# EasyEDA Pro project split-keyboard.epro, schematic Right top

## Sheets
1 P1: Board Name: Right top; Create Date: 2025-12-20; Page Name: P1; Project Name: split-keyboard-2025; Schematic Name: Right top; Update Date: 2025-12-20; Company: EasyEDA.com; Page Size: A4; Version: V1.0
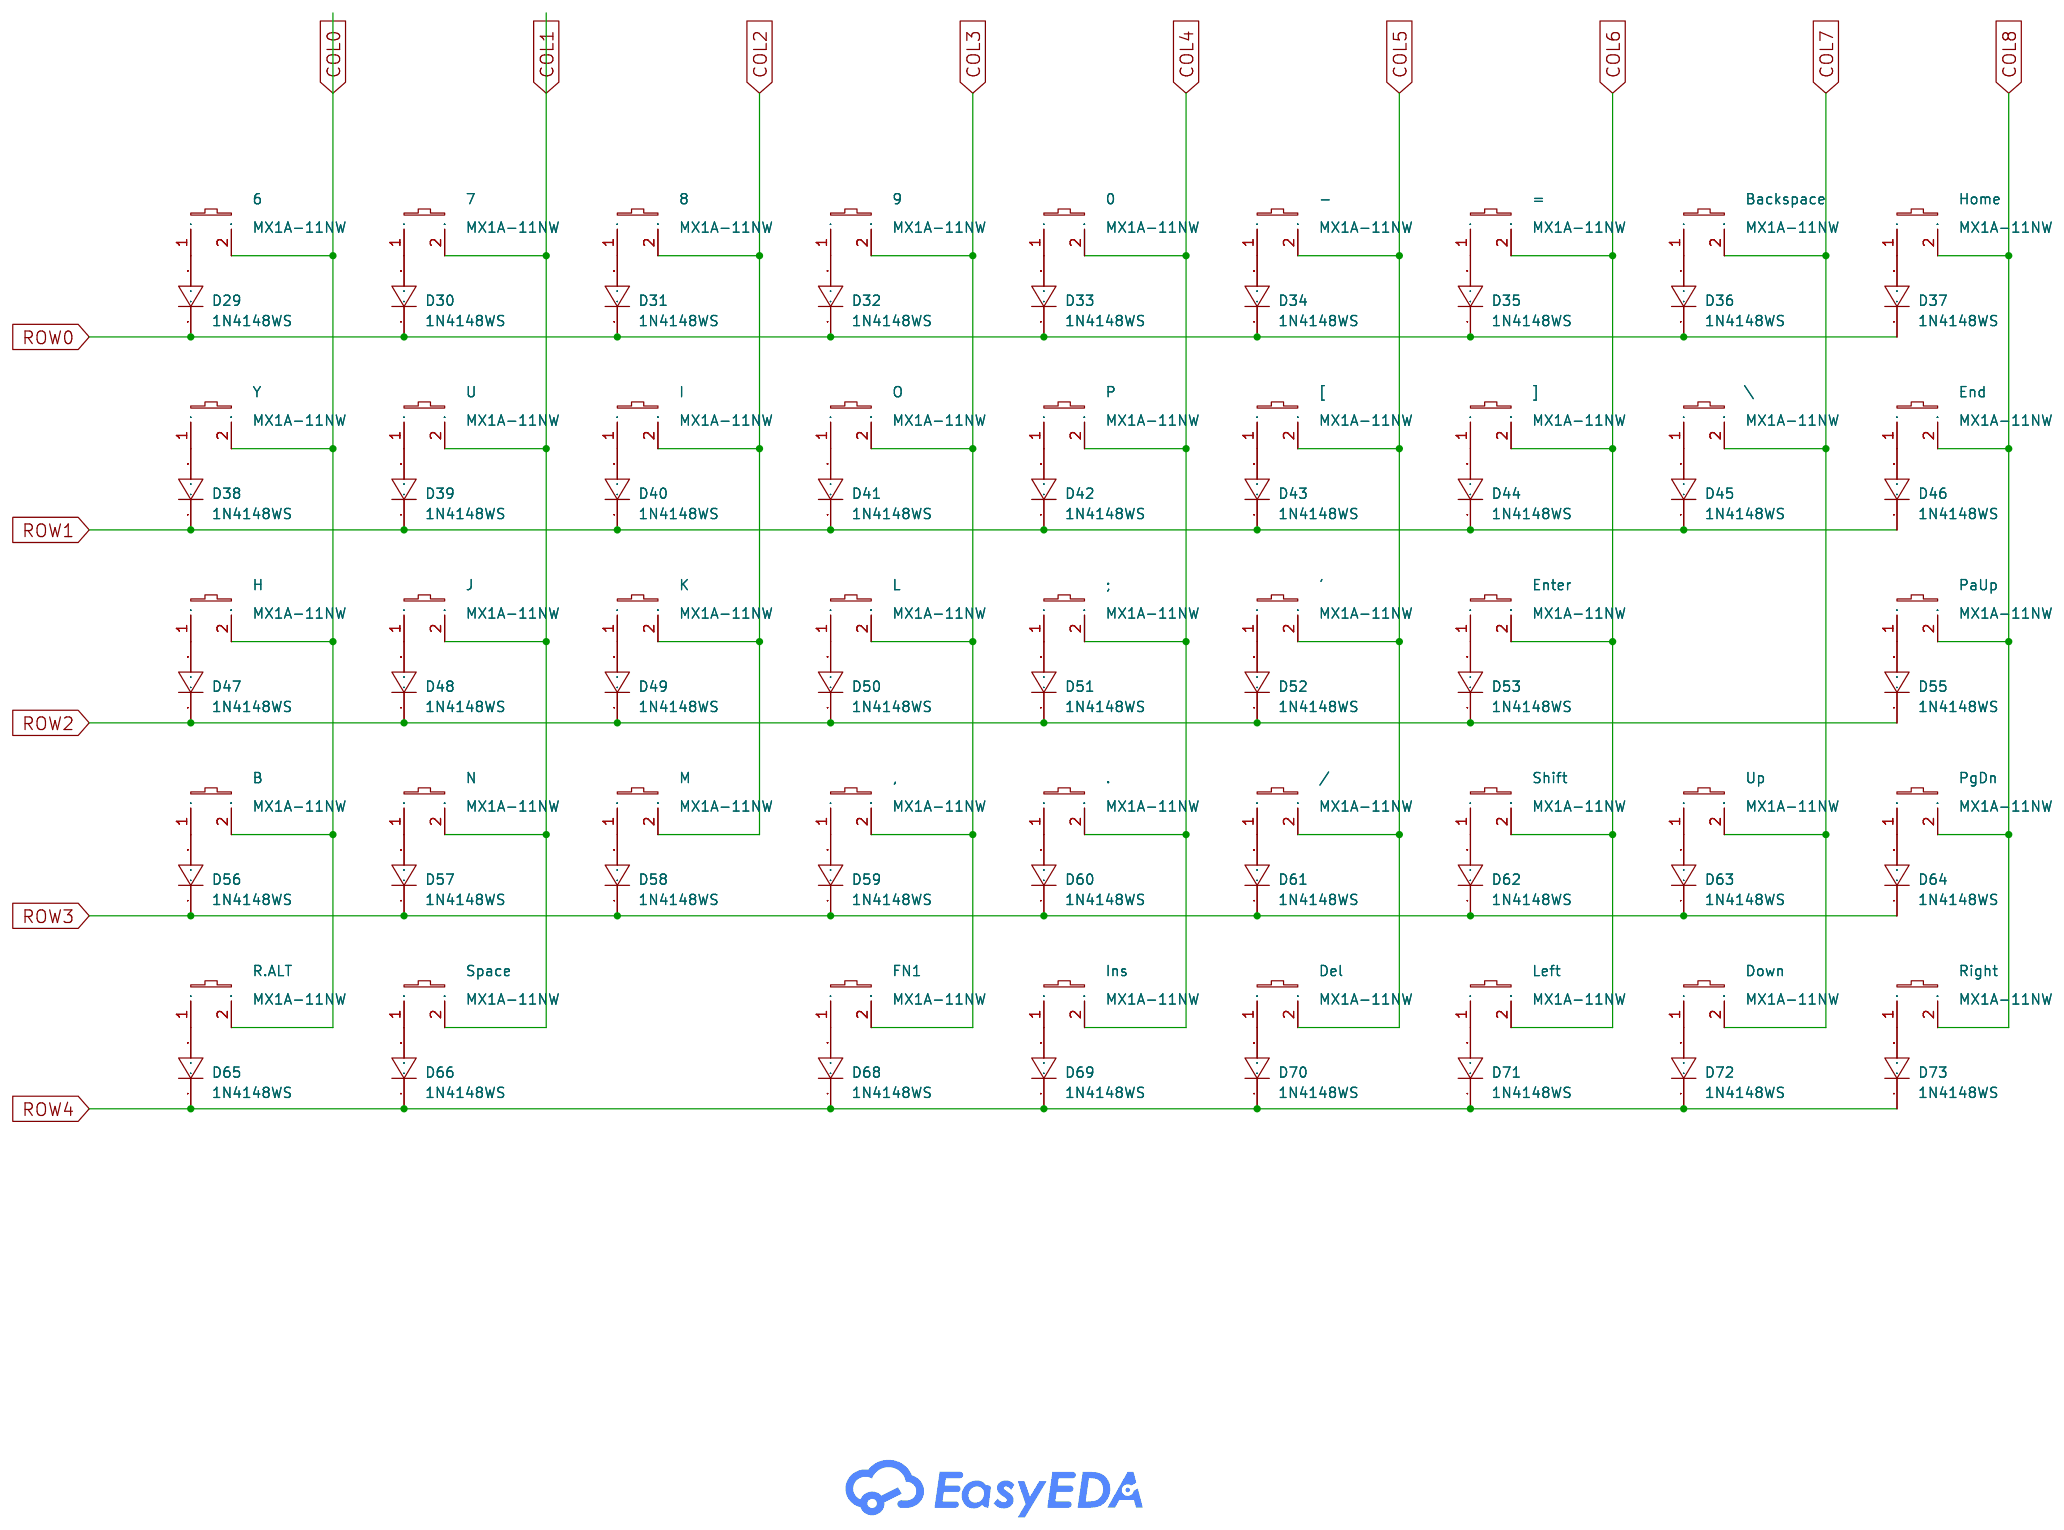
[diagram p3: P1]
2 P2: Page Name: P2
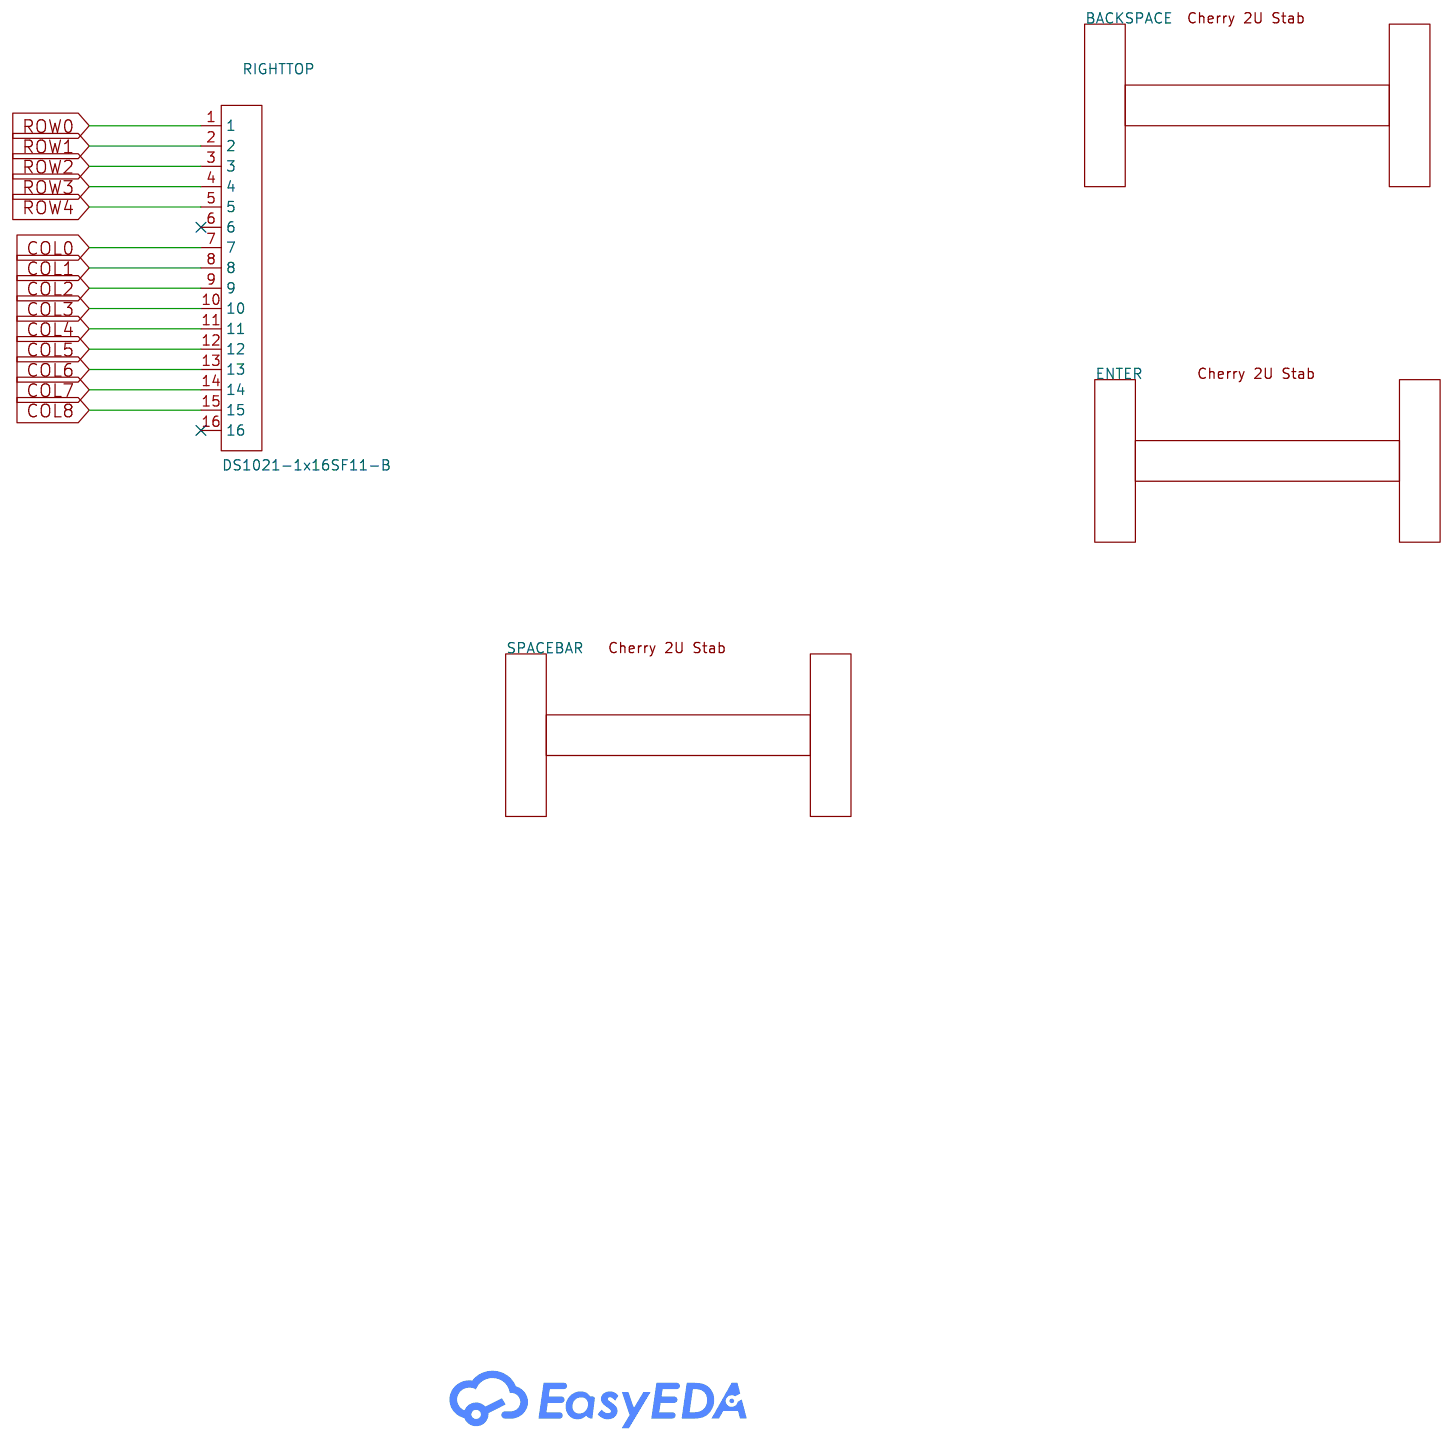
[diagram p4: P2]

## Parts
sheet P1
0  MX1A-11NW  [cherry]
6  MX1A-11NW  [cherry]
7  MX1A-11NW  [cherry]
8  MX1A-11NW  [cherry]
9  MX1A-11NW  [cherry]
'  MX1A-11NW  [cherry]
,  MX1A-11NW  [cherry]
-  MX1A-11NW  [cherry]
.  MX1A-11NW  [cherry]
/  MX1A-11NW  [cherry]
;  MX1A-11NW  [cherry]
=  MX1A-11NW  [cherry]
[  MX1A-11NW  [cherry]
\  MX1A-11NW  [cherry]
]  MX1A-11NW  [cherry]
B  MX1A-11NW  [cherry]
Backspace  MX1A-11NW  [cherry]
D29  1N4148WS  [SOD-323_L1.8-W1.3-LS2.5-RD]
D30  1N4148WS  [SOD-323_L1.8-W1.3-LS2.5-RD]
D31  1N4148WS  [SOD-323_L1.8-W1.3-LS2.5-RD]
D32  1N4148WS  [SOD-323_L1.8-W1.3-LS2.5-RD]
D33  1N4148WS  [SOD-323_L1.8-W1.3-LS2.5-RD]
D34  1N4148WS  [SOD-323_L1.8-W1.3-LS2.5-RD]
D35  1N4148WS  [SOD-323_L1.8-W1.3-LS2.5-RD]
D36  1N4148WS  [SOD-323_L1.8-W1.3-LS2.5-RD]
D37  1N4148WS  [SOD-323_L1.8-W1.3-LS2.5-RD]
D38  1N4148WS  [SOD-323_L1.8-W1.3-LS2.5-RD]
D39  1N4148WS  [SOD-323_L1.8-W1.3-LS2.5-RD]
D40  1N4148WS  [SOD-323_L1.8-W1.3-LS2.5-RD]
D41  1N4148WS  [SOD-323_L1.8-W1.3-LS2.5-RD]
D42  1N4148WS  [SOD-323_L1.8-W1.3-LS2.5-RD]
D43  1N4148WS  [SOD-323_L1.8-W1.3-LS2.5-RD]
D44  1N4148WS  [SOD-323_L1.8-W1.3-LS2.5-RD]
D45  1N4148WS  [SOD-323_L1.8-W1.3-LS2.5-RD]
D46  1N4148WS  [SOD-323_L1.8-W1.3-LS2.5-RD]
D47  1N4148WS  [SOD-323_L1.8-W1.3-LS2.5-RD]
D48  1N4148WS  [SOD-323_L1.8-W1.3-LS2.5-RD]
D49  1N4148WS  [SOD-323_L1.8-W1.3-LS2.5-RD]
D50  1N4148WS  [SOD-323_L1.8-W1.3-LS2.5-RD]
D51  1N4148WS  [SOD-323_L1.8-W1.3-LS2.5-RD]
D52  1N4148WS  [SOD-323_L1.8-W1.3-LS2.5-RD]
D53  1N4148WS  [SOD-323_L1.8-W1.3-LS2.5-RD]
D55  1N4148WS  [SOD-323_L1.8-W1.3-LS2.5-RD]
D56  1N4148WS  [SOD-323_L1.8-W1.3-LS2.5-RD]
D57  1N4148WS  [SOD-323_L1.8-W1.3-LS2.5-RD]
D58  1N4148WS  [SOD-323_L1.8-W1.3-LS2.5-RD]
D59  1N4148WS  [SOD-323_L1.8-W1.3-LS2.5-RD]
D60  1N4148WS  [SOD-323_L1.8-W1.3-LS2.5-RD]
D61  1N4148WS  [SOD-323_L1.8-W1.3-LS2.5-RD]
D62  1N4148WS  [SOD-323_L1.8-W1.3-LS2.5-RD]
D63  1N4148WS  [SOD-323_L1.8-W1.3-LS2.5-RD]
D64  1N4148WS  [SOD-323_L1.8-W1.3-LS2.5-RD]
D65  1N4148WS  [SOD-323_L1.8-W1.3-LS2.5-RD]
D66  1N4148WS  [SOD-323_L1.8-W1.3-LS2.5-RD]
D68  1N4148WS  [SOD-323_L1.8-W1.3-LS2.5-RD]
D69  1N4148WS  [SOD-323_L1.8-W1.3-LS2.5-RD]
D70  1N4148WS  [SOD-323_L1.8-W1.3-LS2.5-RD]
D71  1N4148WS  [SOD-323_L1.8-W1.3-LS2.5-RD]
D72  1N4148WS  [SOD-323_L1.8-W1.3-LS2.5-RD]
D73  1N4148WS  [SOD-323_L1.8-W1.3-LS2.5-RD]
Del  MX1A-11NW  [cherry]
Down  MX1A-11NW  [cherry]
End  MX1A-11NW  [cherry]
Enter  MX1A-11NW  [cherry]
FN1  MX1A-11NW  [cherry]
H  MX1A-11NW  [cherry]
Home  MX1A-11NW  [cherry]
I  MX1A-11NW  [cherry]
Ins  MX1A-11NW  [cherry]
J  MX1A-11NW  [cherry]
K  MX1A-11NW  [cherry]
L  MX1A-11NW  [cherry]
Left  MX1A-11NW  [cherry]
M  MX1A-11NW  [cherry]
N  MX1A-11NW  [cherry]
O  MX1A-11NW  [cherry]
P  MX1A-11NW  [cherry]
PaUp  MX1A-11NW  [cherry]
PgDn  MX1A-11NW  [cherry]
R.ALT  MX1A-11NW  [cherry]
Right  MX1A-11NW  [cherry]
Shift  MX1A-11NW  [cherry]
Space  MX1A-11NW  [cherry]
U  MX1A-11NW  [cherry]
Up  MX1A-11NW  [cherry]
Y  MX1A-11NW  [cherry]
sheet P2
BACKSPACE  -  [Cherry 2U Stabilizer Cutout]
ENTER  -  [Cherry 2U Stabilizer Cutout]
RIGHTTOP  DS1021-1x16SF11-B  [HDR-TH_16P-P2.54-V-M]
SPACEBAR  -  [Cherry 2U Stabilizer Cutout]

## Library data of the parts
0 6-9 ' , - . / ; = [ \ ] B Backspace Del Down End Enter FN1 H Home I Ins J K L Left M N O P PaUp PgDn R.ALT Right Shift Space U Up Y = MX1A-11NW: Supplier Part: C3316924; Manufacturer: CHERRY; JLCPCB Part Class: Extended Part; Datasheet: https://item.szlcsc.com/datasheet/MX1A-11NW/3881518.html; Supplier: LCSC
D29-D53 D55-D66 D68-D73 = 1N4148WS_C2128: Diode Configuration:Independent Voltage - Forward(Vf@If):1.25V@150mA Voltage - DC Reverse(Vr):100V Current - Rectified:150mA Pd - Power Dissipation:200mW Reverse Leakage Current (Ir):1uA@75V Reverse Recovery Time (trr):4ns Operating Junction Temperature R; LCSC Part Name: 丝印T4 1N4148WS; Supplier Part: C2128; Manufacturer: CJ(江苏长电/长晶); Supplier Footprint: SOD-323; JLCPCB Part Class: Basic Part; Datasheet: https://item.szlcsc.com/datasheet/1N4148WS/2485.html; Supplier: LCSC; Diode Configuration: Independent; Voltage - Forward(Vf@If): 1.25V@150mA; Voltage - DC Reverse(Vr): 100V; Current - Rectified: 150mA; Pd - Power Dissipation: 200mW; Reverse Leakage Current (Ir): 1uA@75V; Reverse Recovery Time (trr): 4ns; Non-Repetitive Peak Forward Surge Current: 2A
BACKSPACE ENTER SPACEBAR = Cherry 2u Stabilizer Cutout
RIGHTTOP = DS1021-1x16SF11-B: Pin Structure:1x16P Pitch:2.54mm Circluar Pins/Square Pins:Pin Header Mounting Type:Through Hole Number of Rows:1 Number of Pins:16P Current Rating:3A Voltage Rating (Max):250V Contact Material:Copper Alloy Contact Plating:Gold Operating Temperature:-40℃~; LCSC Part Name: 1x16P 间距:2.54mm 方针 直插; Supplier Part: C7430372; Manufacturer: CONNFLY; Supplier Footprint: 插件,P=2.54mm; JLCPCB Part Class: Extended Part; Datasheet: https://item.szlcsc.com/datasheet/DS1021-1x16SF11-B/8430025.html; Supplier: LCSC; Pin Structure: 1x16P; Pitch: 2.54mm; Circluar Pins/Square Pins: Pin Header; Mounting Type: Through Hole; Number of Rows: 1; Number of Pins: 16P; Current Rating: 3A; Voltage Rating (Max): 250V; Contact Material: Copper Alloy; Contact Plating: Gold; Operating Temperature: -40℃~+105℃; Color: Black

## Nets
COL0: 6.2 B.2 H.2 R.ALT.2 RIGHTTOP.7 Y.2
COL1: 7.2 J.2 N.2 RIGHTTOP.8 Space.2 U.2
COL2: 8.2 I.2 K.2 M.2 RIGHTTOP.9
COL3: 9.2 ,.2 FN1.2 L.2 O.2 RIGHTTOP.10
COL4: 0.2 ..2 ;.2 Ins.2 P.2 RIGHTTOP.11
COL5: '.2 -.2 /.2 [.2 Del.2 RIGHTTOP.12
COL6: =.2 ].2 Enter.2 Left.2 RIGHTTOP.13 Shift.2
COL7: \.2 Backspace.2 Down.2 RIGHTTOP.14 Up.2
COL8: End.2 Home.2 PaUp.2 PgDn.2 Right.2 RIGHTTOP.15
ROW0: D29.1(K) D30.1(K) D31.1(K) D32.1(K) D33.1(K) D34.1(K) D35.1(K) D36.1(K) D37.1(K) RIGHTTOP.1
ROW1: D38.1(K) D39.1(K) D40.1(K) D41.1(K) D42.1(K) D43.1(K) D44.1(K) D45.1(K) D46.1(K) RIGHTTOP.2
ROW2: D47.1(K) D48.1(K) D49.1(K) D50.1(K) D51.1(K) D52.1(K) D53.1(K) D55.1(K) RIGHTTOP.3
ROW3: D56.1(K) D57.1(K) D58.1(K) D59.1(K) D60.1(K) D61.1(K) D62.1(K) D63.1(K) D64.1(K) RIGHTTOP.4
ROW4: D65.1(K) D66.1(K) D68.1(K) D69.1(K) D70.1(K) D71.1(K) D72.1(K) D73.1(K) RIGHTTOP.5
$1N131: 6.1 D29.2(A)
$1N2292: 7.1 D30.2(A)
$1N2364: 8.1 D31.2(A)
$1N2436: 9.1 D32.2(A)
$1N2508: 0.1 D33.2(A)
$1N2580: -.1 D34.2(A)
$1N2652: =.1 D35.2(A)
$1N2724: Backspace.1 D36.2(A)
$1N2796: D37.2(A) Home.1
$1N2868: D38.2(A) Y.1
$1N2940: D39.2(A) U.1
$1N3012: D40.2(A) I.1
$1N3084: D41.2(A) O.1
$1N3156: D42.2(A) P.1
$1N3228: [.1 D43.2(A)
$1N3300: ].1 D44.2(A)
$1N3372: \.1 D45.2(A)
$1N3444: D46.2(A) End.1
$1N3516: D47.2(A) H.1
$1N3588: D48.2(A) J.1
$1N3660: D49.2(A) K.1
$1N3732: D50.2(A) L.1
$1N3804: ;.1 D51.2(A)
$1N3876: '.1 D52.2(A)
$1N3948: D53.2(A) Enter.1
$1N4092: D55.2(A) PaUp.1
$1N4164: B.1 D56.2(A)
$1N4236: D57.2(A) N.1
$1N4308: D58.2(A) M.1
$1N4380: ,.1 D59.2(A)
$1N4452: ..1 D60.2(A)
$1N4524: /.1 D61.2(A)
$1N4596: D62.2(A) Shift.1
$1N4668: D63.2(A) Up.1
$1N4740: D64.2(A) PgDn.1
$1N4812: D65.2(A) R.ALT.1
$1N4884: D66.2(A) Space.1
$1N5028: D68.2(A) FN1.1
$1N5100: D69.2(A) Ins.1
$1N5172: D70.2(A) Del.1
$1N5244: D71.2(A) Left.1
$1N5316: D72.2(A) Down.1
$1N5388: D73.2(A) Right.1

Not connected (* = marked no-connect by the designer): RIGHTTOP 6* 16*
